# EAGLE board LEDpanel (EAGLE 6.6.0), part 1 of 2
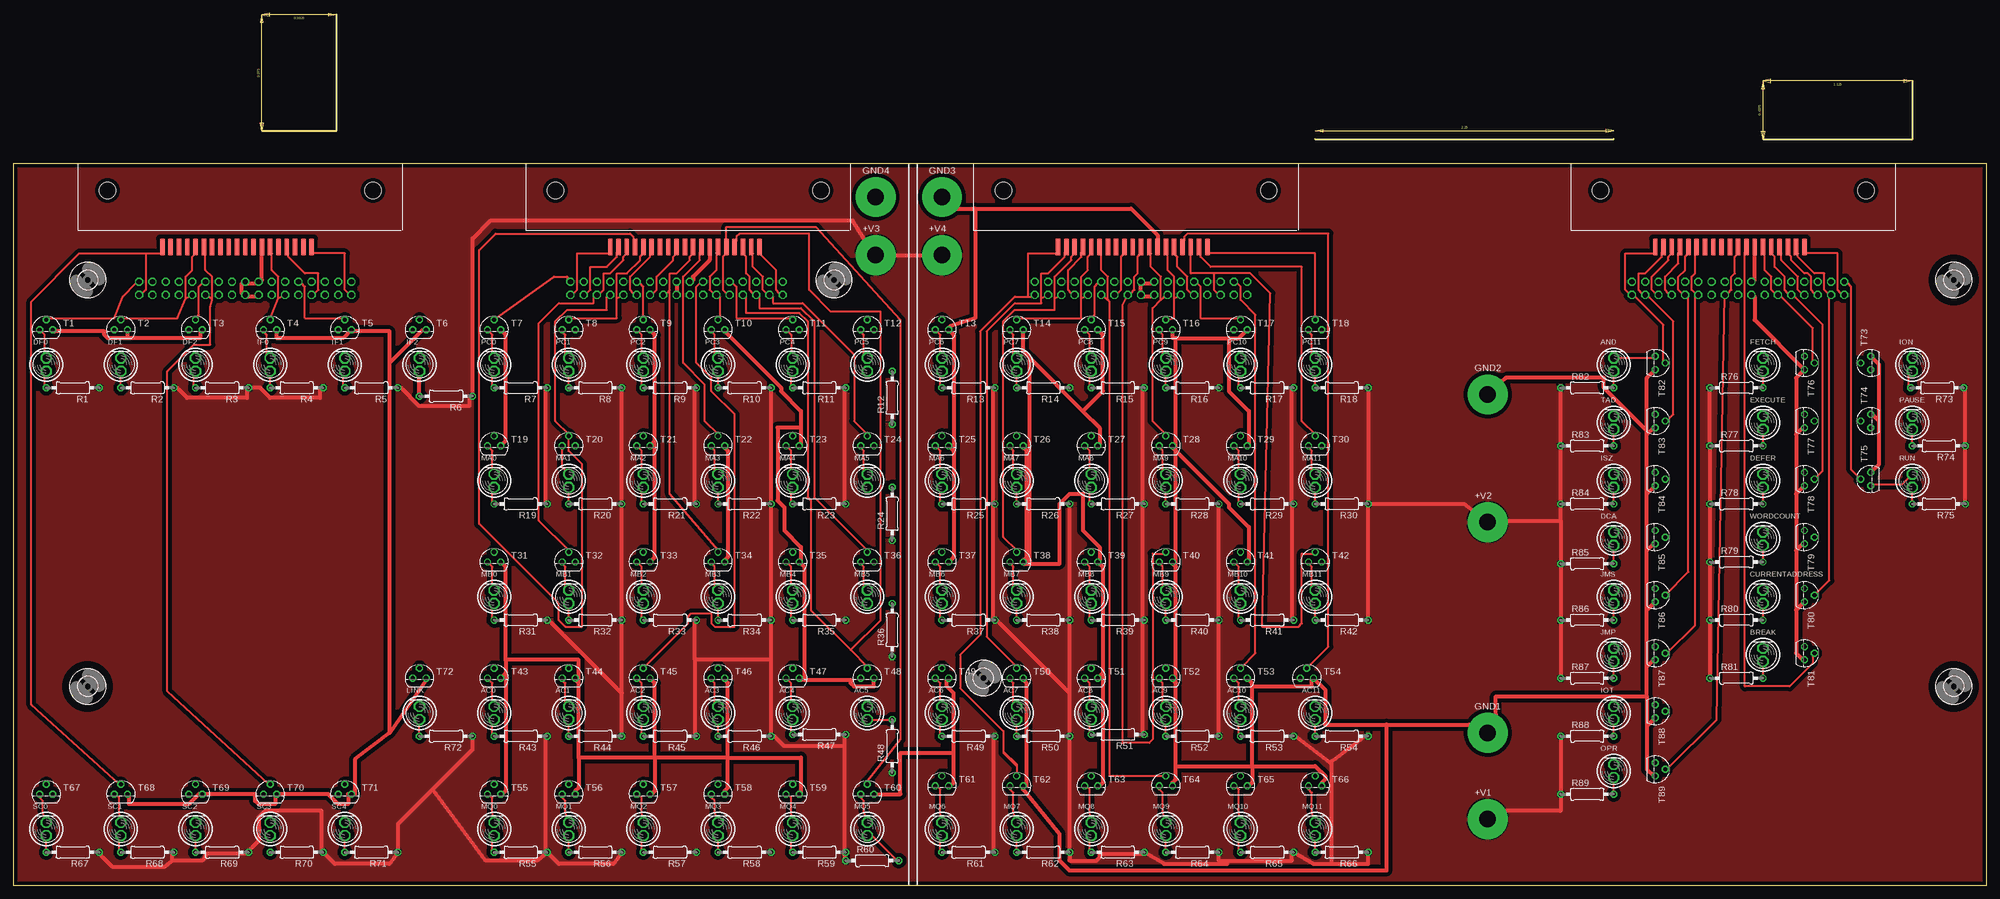
[diagram p2: board, top side]
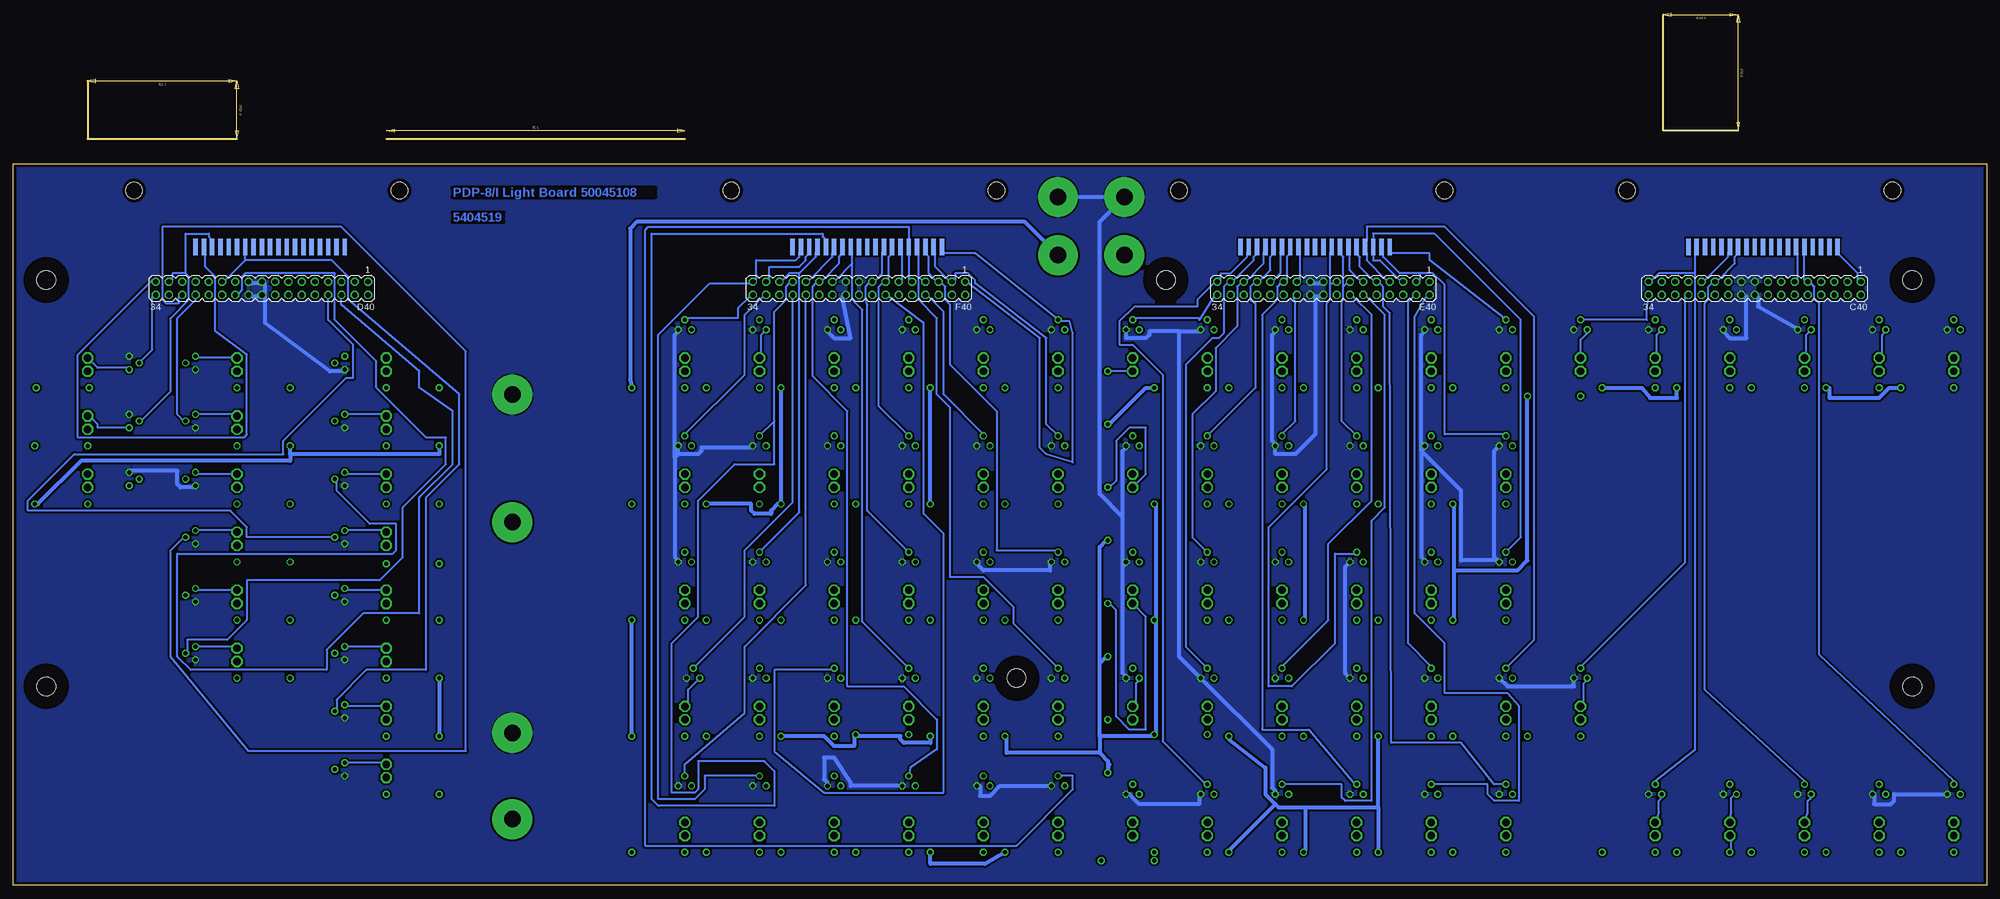
[diagram p3: board, bottom side, seen from below]

Size 377.82 x 166.69 mm. Coordinates in mm from the lower left corner, seen from the top.
Outline: 47.62,144.46 61.91,144.46 61.91,166.69
Outline: 334.96,142.88 363.54,142.88 363.54,153.99
Outline: 249.24,142.88 306.39,142.88
Outline: 377.82,0 377.82,138.11 0,138.11 0,0 377.82,0
Copper layers (1+16): Top 0.035mm / dielectric 1.5mm / Bottom 0.035mm
Design rules "15mils *": minimum track width 15mil, minimum drill 24mil, track to track 15mil, track to pad 10mil, pad to pad 10mil, via to via 10mil, smd to smd 10mil, copper to edge 25mil, drill to drill 10mil, minimum pad ring 10mil, minimum via ring 8mil, stop-mask expansion 0mil, vias tented up to drill 0mil, thermal gap 10mil
Net classes: 1 supply: width 0.762 mm

## Footprints (pad centres in the part's own frame; a part is rotated, then mirrored left to right if it is on the bottom)
SPADELUG = drill 3.175 pad 7.62: 1 0,0
BULB = drill 1.422 octagon: A 0,0; B 0,2.54
MA17-2 = drill 1.016 octagon: 1 -20.32,-1.27; 2 -20.32,1.27; 3 -17.78,-1.27; 4 -17.78,1.27; 5 -15.24,-1.27; 6 -15.24,1.27; 7 -12.7,-1.27; 8 -12.7,1.27; 9 -10.16,-1.27; 10 -10.16,1.27; 11 -7.62,-1.27; 12 -7.62,1.27; 13 -5.08,-1.27; 14 -5.08,1.27; 15 -2.54,-1.27; 16 -2.54,1.27; 17 0,-1.27; 18 0,1.27; 19 2.54,-1.27; 20 2.54,1.27; 21 5.08,-1.27; 22 5.08,1.27; 23 7.62,-1.27; 24 7.62,1.27; 25 10.16,-1.27; 26 10.16,1.27; 27 12.7,-1.27; 28 12.7,1.27; 29 15.24,-1.27; 30 15.24,1.27; 31 17.78,-1.27; 32 17.78,1.27; 33 20.32,-1.27; 34 20.32,1.27
FLEX19 = smd 3.175 x 0.838: 1 0,14.287; 2 0,12.7; 3 0,11.113; 4 0,9.525; 5 0,7.938; 6 0,6.35; 7 0,4.763; 8 0,3.175; 9 0,1.587; 10 0,0; 11 0,-1.587; 12 0,-3.175; 13 0,-4.763; 14 0,-6.35; 15 0,-7.938; 16 0,-9.525; 17 0,-11.113; 18 0,-12.7; 19 0,-14.287
0207/10 = drill 0.813 octagon: 1 -5.08,0; 2 5.08,0
TO92 = drill 0.813 octagon: 1 1.27,0; 2 0,1.905; 3 -1.27,0
STRAIN-RELIEF = hole 3.175: 7.62,56.515; 7.62,5.715
3,6 = hole 3.6: 0,0

## Placement (x,y rotation side)
+V1  LUG  [SPADELUG]  282.26,12.7 0 top
+V2  LUG  [SPADELUG]  282.26,69.53 0 top
+V3  LUG  [SPADELUG]  165.1,120.65 0 top
+V4  LUG  [SPADELUG]  177.8,120.65 0 top
AC0  [BULB]  92.08,31.75 0 top
AC1  [BULB]  106.36,31.75 0 top
AC2  [BULB]  120.65,31.75 0 top
AC3  [BULB]  134.94,31.75 0 top
AC4  [BULB]  149.22,31.75 0 top
AC5  [BULB]  163.51,31.75 0 top
AC6  [BULB]  177.8,31.75 0 top
AC7  [BULB]  192.09,31.75 0 top
AC8  [BULB]  206.38,31.75 0 top
AC9  [BULB]  220.66,31.75 0 top
AC10  [BULB]  234.95,31.75 0 top
AC11  [BULB]  249.24,31.75 0 top
AND  [BULB]  306.39,98.42 0 top
BREAK  [BULB]  334.96,42.86 0 top
C40  [MA17-2]  44.45,114.3 180 bottom
C40BOT  FLEX19  [FLEX19]  42.86,122.24 90 top
C40TOP  FLEX19  [FLEX19]  42.86,122.24 270 bottom
CURRENTADDRESS  [BULB]  334.96,53.98 0 top
D40  [MA17-2]  330.2,114.3 180 bottom
D40BOT  FLEX19  [FLEX19]  128.59,122.24 90 top
D40TOP  FLEX19  [FLEX19]  128.59,122.24 270 bottom
DCA  [BULB]  306.39,65.09 0 top
DEFER  [BULB]  334.96,76.2 0 top
DF0  [BULB]  6.35,98.42 0 top
DF1  [BULB]  20.64,98.42 0 top
DF2  [BULB]  34.92,98.42 0 top
E40  [MA17-2]  127,114.3 180 bottom
E40BOT  FLEX19  [FLEX19]  214.31,122.24 90 top
E40TOP  FLEX19  [FLEX19]  214.31,122.24 270 bottom
EXECUTE  [BULB]  334.96,87.31 0 top
F40  [MA17-2]  215.9,114.3 180 bottom
F40BOT  FLEX19  [FLEX19]  328.61,122.24 90 top
F40TOP  FLEX19  [FLEX19]  328.61,122.24 270 bottom
FETCH  [BULB]  334.96,98.42 0 top
GND1  LUG  [SPADELUG]  282.26,29.21 0 top
GND2  LUG  [SPADELUG]  282.26,93.98 0 top
GND3  LUG  [SPADELUG]  177.8,131.76 0 top
GND4  LUG  [SPADELUG]  165.1,131.76 0 top
IF0  [BULB]  49.21,98.42 0 top
IF1  [BULB]  63.5,98.42 0 top
IF2  [BULB]  77.79,98.42 0 top
ION  [BULB]  363.54,98.42 0 top
IOT  [BULB]  306.39,31.75 0 top
ISZ  [BULB]  306.39,76.2 0 top
JMP  [BULB]  306.39,42.86 0 top
JMS  [BULB]  306.39,53.98 0 top
LINK  [BULB]  77.79,31.75 0 top
MA0  [BULB]  92.08,76.2 0 top
MA1  [BULB]  106.36,76.2 0 top
MA2  [BULB]  120.65,76.2 0 top
MA3  [BULB]  134.94,76.2 0 top
MA4  [BULB]  149.22,76.2 0 top
MA5  [BULB]  163.51,76.2 0 top
MA6  [BULB]  177.8,76.2 0 top
MA7  [BULB]  192.09,76.2 0 top
MA8  [BULB]  206.38,76.2 0 top
MA9  [BULB]  220.66,76.2 0 top
MA10  [BULB]  234.95,76.2 0 top
MA11  [BULB]  249.24,76.2 0 top
MB0  [BULB]  92.08,53.98 0 top
MB1  [BULB]  106.36,53.98 0 top
MB2  [BULB]  120.65,53.98 0 top
MB3  [BULB]  134.94,53.98 0 top
MB4  [BULB]  149.22,53.98 0 top
MB5  [BULB]  163.51,53.98 0 top
MB6  [BULB]  177.8,53.98 0 top
MB7  [BULB]  192.09,53.98 0 top
MB8  [BULB]  206.38,53.98 0 top
MB9  [BULB]  220.66,53.98 0 top
MB10  [BULB]  234.95,53.98 0 top
MB11  [BULB]  249.24,53.98 0 top
MQ0  [BULB]  92.08,9.53 0 top
MQ1  [BULB]  106.36,9.53 0 top
MQ2  [BULB]  120.65,9.53 0 top
MQ3  [BULB]  134.94,9.53 0 top
MQ4  [BULB]  149.22,9.53 0 top
MQ5  [BULB]  163.51,9.53 0 top
MQ6  [BULB]  177.8,9.53 0 top
MQ7  [BULB]  192.09,9.53 0 top
MQ8  [BULB]  206.38,9.53 0 top
MQ9  [BULB]  220.66,9.53 0 top
MQ10  [BULB]  234.95,9.53 0 top
MQ11  [BULB]  249.24,9.53 0 top
OPR  [BULB]  306.39,20.64 0 top
PAUSE  [BULB]  363.54,87.31 0 top
PC0  [BULB]  92.08,98.42 0 top
PC1  [BULB]  106.36,98.42 0 top
PC2  [BULB]  120.65,98.42 0 top
PC3  [BULB]  134.94,98.42 0 top
PC4  [BULB]  149.22,98.42 0 top
PC5  [BULB]  163.51,98.42 0 top
PC6  [BULB]  177.8,98.42 0 top
PC7  [BULB]  192.09,98.42 0 top
PC8  [BULB]  206.38,98.42 0 top
PC9  [BULB]  220.66,98.42 0 top
PC10  [BULB]  234.95,98.42 0 top
PC11  [BULB]  249.24,98.42 0 top
R1  1.5K  [0207/10]  11.43,95.25 180 top
R2  1.5K  [0207/10]  25.72,95.25 180 top
R3  1.5K  [0207/10]  40.01,95.25 180 top
R4  1.5K  [0207/10]  54.29,95.25 180 top
R5  1.5K  [0207/10]  68.58,95.25 180 top
R6  1.5K  [0207/10]  82.87,93.66 180 top
R7  1.5K  [0207/10]  97.16,95.25 180 top
R8  1.5K  [0207/10]  111.44,95.25 180 top
R9  1.5K  [0207/10]  125.73,95.25 180 top
R10  1.5K  [0207/10]  140.02,95.25 180 top
R11  1.5K  [0207/10]  154.31,95.25 180 top
R12  1.5K  [0207/10]  168.28,93.34 90 top
R13  1.5K  [0207/10]  182.88,95.25 180 top
R14  1.5K  [0207/10]  197.17,95.25 180 top
R15  1.5K  [0207/10]  211.46,95.25 180 top
R16  1.5K  [0207/10]  225.74,95.25 180 top
R17  1.5K  [0207/10]  240.03,95.25 180 top
R18  1.5K  [0207/10]  254.32,95.25 180 top
R19  1.5K  [0207/10]  97.16,73.03 180 top
R20  1.5K  [0207/10]  111.44,73.03 180 top
R21  1.5K  [0207/10]  125.73,73.03 180 top
R22  1.5K  [0207/10]  140.02,73.03 180 top
R23  1.5K  [0207/10]  154.31,73.03 180 top
R24  1.5K  [0207/10]  168.28,71.12 90 top
R25  1.5K  [0207/10]  182.88,73.03 180 top
R26  1.5K  [0207/10]  197.17,73.03 180 top
R27  1.5K  [0207/10]  211.46,73.03 180 top
R28  1.5K  [0207/10]  225.74,73.03 180 top
R29  1.5K  [0207/10]  240.03,73.03 180 top
R30  1.5K  [0207/10]  254.32,73.03 180 top
R31  1.5K  [0207/10]  97.16,50.8 180 top
R32  1.5K  [0207/10]  111.44,50.8 180 top
R33  1.5K  [0207/10]  125.73,50.8 180 top
R34  1.5K  [0207/10]  140.02,50.8 180 top
R35  1.5K  [0207/10]  154.31,50.8 180 top
R36  1.5K  [0207/10]  168.28,48.9 90 top
R37  1.5K  [0207/10]  182.88,50.8 180 top
R38  1.5K  [0207/10]  197.17,50.8 180 top
R39  1.5K  [0207/10]  211.46,50.8 180 top
R40  1.5K  [0207/10]  225.74,50.8 180 top
R41  1.5K  [0207/10]  240.03,50.8 180 top
R42  1.5K  [0207/10]  254.32,50.8 180 top
R43  1.5K  [0207/10]  97.16,28.57 180 top
R44  1.5K  [0207/10]  111.44,28.57 180 top
R45  1.5K  [0207/10]  125.73,28.57 180 top
R46  1.5K  [0207/10]  140.02,28.57 180 top
R47  1.5K  [0207/10]  154.31,28.89 180 top
R48  1.5K  [0207/10]  168.28,26.67 90 top
R49  1.5K  [0207/10]  182.88,28.57 180 top
R50  1.5K  [0207/10]  197.17,28.57 180 top
R51  1.5K  [0207/10]  211.46,28.89 180 top
R52  1.5K  [0207/10]  225.74,28.57 180 top
R53  1.5K  [0207/10]  240.03,28.57 180 top
R54  1.5K  [0207/10]  254.32,28.57 180 top
R55  1.5K  [0207/10]  97.16,6.35 180 top
R56  1.5K  [0207/10]  111.44,6.35 180 top
R57  1.5K  [0207/10]  125.73,6.35 180 top
R58  1.5K  [0207/10]  140.02,6.35 180 top
R59  1.5K  [0207/10]  154.31,6.35 180 top
R60  1.5K  [0207/10]  164.47,4.76 0 top
R61  1.5K  [0207/10]  182.88,6.35 180 top
R62  1.5K  [0207/10]  197.17,6.35 180 top
R63  1.5K  [0207/10]  211.46,6.35 180 top
R64  1.5K  [0207/10]  225.74,6.35 180 top
R65  1.5K  [0207/10]  240.03,6.35 180 top
R66  1.5K  [0207/10]  254.32,6.35 180 top
R67  1.5K  [0207/10]  11.43,6.35 180 top
R68  1.5K  [0207/10]  25.72,6.35 180 top
R69  1.5K  [0207/10]  40.01,6.35 180 top
R70  1.5K  [0207/10]  54.29,6.35 180 top
R71  1.5K  [0207/10]  68.58,6.35 180 top
R72  1.5K  [0207/10]  82.87,28.57 180 top
R73  1.5K  [0207/10]  368.3,95.25 180 top
R74  1.5K  [0207/10]  368.62,84.14 180 top
R75  1.5K  [0207/10]  368.62,73.03 180 top
R76  1.5K  [0207/10]  329.88,95.25 0 top
R77  1.5K  [0207/10]  329.88,84.14 0 top
R78  1.5K  [0207/10]  329.88,73.03 0 top
R79  1.5K  [0207/10]  329.88,61.91 0 top
R80  1.5K  [0207/10]  329.88,50.8 0 top
R81  1.5K  [0207/10]  329.88,39.69 0 top
R82  1.5K  [0207/10]  301.31,95.25 0 top
R83  1.5K  [0207/10]  301.31,84.14 0 top
R84  1.5K  [0207/10]  301.31,73.03 0 top
R85  1.5K  [0207/10]  301.31,61.59 0 top
R86  1.5K  [0207/10]  301.31,50.8 0 top
R87  1.5K  [0207/10]  301.31,39.69 0 top
R88  1.5K  [0207/10]  301.31,28.57 0 top
R89  1.5K  [0207/10]  301.31,17.46 0 top
RUN  [BULB]  363.54,76.2 0 top
SC0  [BULB]  6.35,9.53 0 top
SC1  [BULB]  20.64,9.53 0 top
SC2  [BULB]  34.92,9.53 0 top
SC3  [BULB]  49.21,9.53 0 top
SC4  [BULB]  63.5,9.53 0 top
T1  2N2222  [TO92]  6.35,106.36 0 top
T2  2N2222  [TO92]  20.64,106.36 0 top
T3  2N2222  [TO92]  34.92,106.36 0 top
T4  2N2222  [TO92]  49.21,106.36 0 top
T5  2N2222  [TO92]  63.5,106.36 0 top
T6  2N2222  [TO92]  77.79,106.36 0 top
T7  2N2222  [TO92]  92.08,106.36 0 top
T8  2N2222  [TO92]  106.36,106.36 0 top
T9  2N2222  [TO92]  120.65,106.36 0 top
T10  2N2222  [TO92]  134.94,106.36 0 top
T11  2N2222  [TO92]  149.22,106.36 0 top
T12  2N2222  [TO92]  163.51,106.36 0 top
T13  2N2222  [TO92]  177.8,106.36 0 top
T14  2N2222  [TO92]  192.09,106.36 0 top
T15  2N2222  [TO92]  206.38,106.36 0 top
T16  2N2222  [TO92]  220.66,106.36 0 top
T17  2N2222  [TO92]  234.95,106.36 0 top
T18  2N2222  [TO92]  249.24,106.36 0 top
T19  2N2222  [TO92]  92.08,84.14 0 top
T20  2N2222  [TO92]  106.36,84.14 0 top
T21  2N2222  [TO92]  120.65,84.14 0 top
T22  2N2222  [TO92]  134.94,84.14 0 top
T23  2N2222  [TO92]  149.22,84.14 0 top
T24  2N2222  [TO92]  163.51,84.14 0 top
T25  2N2222  [TO92]  177.8,84.14 0 top
T26  2N2222  [TO92]  192.09,84.14 0 top
T27  2N2222  [TO92]  206.38,84.14 0 top
T28  2N2222  [TO92]  220.66,84.14 0 top
T29  2N2222  [TO92]  234.95,84.14 0 top
T30  2N2222  [TO92]  249.24,84.14 0 top
T31  2N2222  [TO92]  92.08,61.91 0 top
T32  2N2222  [TO92]  106.36,61.91 0 top
T33  2N2222  [TO92]  120.65,61.91 0 top
T34  2N2222  [TO92]  134.94,61.91 0 top
T35  2N2222  [TO92]  149.22,61.91 0 top
T36  2N2222  [TO92]  163.51,61.91 0 top
T37  2N2222  [TO92]  177.8,61.91 0 top
T38  2N2222  [TO92]  192.09,61.91 0 top
T39  2N2222  [TO92]  206.38,61.91 0 top
T40  2N2222  [TO92]  220.66,61.91 0 top
T41  2N2222  [TO92]  234.95,61.91 0 top
T42  2N2222  [TO92]  249.24,61.91 0 top
T43  2N2222  [TO92]  92.08,39.69 0 top
T44  2N2222  [TO92]  106.36,39.69 0 top
T45  2N2222  [TO92]  120.65,39.69 0 top
T46  2N2222  [TO92]  134.94,39.69 0 top
T47  2N2222  [TO92]  149.22,39.69 0 top
T48  2N2222  [TO92]  163.51,39.69 0 top
T49  2N2222  [TO92]  177.8,39.69 0 top
T50  2N2222  [TO92]  192.09,39.69 0 top
T51  2N2222  [TO92]  206.38,39.69 0 top
T52  2N2222  [TO92]  220.66,39.69 0 top
T53  2N2222  [TO92]  234.95,39.69 0 top
T54  2N2222  [TO92]  247.65,39.69 0 top
T55  2N2222  [TO92]  92.08,17.46 0 top
T56  2N2222  [TO92]  106.36,17.46 0 top
T57  2N2222  [TO92]  120.65,17.46 0 top
T58  2N2222  [TO92]  134.94,17.46 0 top
T59  2N2222  [TO92]  149.22,17.46 0 top
T60  2N2222  [TO92]  163.51,17.46 0 top
T61  2N2222  [TO92]  177.8,19.05 0 top
T62  2N2222  [TO92]  192.09,19.05 0 top
T63  2N2222  [TO92]  206.38,19.05 0 top
T64  2N2222  [TO92]  220.66,19.05 0 top
T65  2N2222  [TO92]  234.95,19.05 0 top
T66  2N2222  [TO92]  249.24,19.05 0 top
T67  2N2222  [TO92]  6.35,17.46 0 top
T68  2N2222  [TO92]  20.64,17.46 0 top
T69  2N2222  [TO92]  34.92,17.46 0 top
T70  2N2222  [TO92]  49.21,17.46 0 top
T71  2N2222  [TO92]  63.5,17.46 0 top
T72  2N2222  [TO92]  77.79,39.69 0 top
T73  2N2222  [TO92]  355.6,100.01 90 top
T74  2N2222  [TO92]  355.6,88.9 90 top
T75  2N2222  [TO92]  355.6,77.79 90 top
T76  2N2222  [TO92]  342.9,100.01 270 top
T77  2N2222  [TO92]  342.9,88.9 270 top
T78  2N2222  [TO92]  342.9,77.79 270 top
T79  2N2222  [TO92]  342.9,66.67 270 top
T80  2N2222  [TO92]  342.9,55.56 270 top
T81  2N2222  [TO92]  342.9,44.45 270 top
T82  2N2222  [TO92]  314.32,100.01 270 top
T83  2N2222  [TO92]  314.32,88.9 270 top
T84  2N2222  [TO92]  314.32,77.79 270 top
T85  2N2222  [TO92]  314.32,66.67 270 top
T86  2N2222  [TO92]  314.32,55.56 270 top
T87  2N2222  [TO92]  314.32,44.45 270 top
T88  2N2222  [TO92]  314.32,33.34 270 top
T89  2N2222  [TO92]  314.32,22.23 270 top
TAD  [BULB]  306.39,87.31 0 top
U$1  [STRAIN-RELIEF]  74.61,125.41 90 top
U$2  [STRAIN-RELIEF]  160.34,125.41 90 top
U$3  [STRAIN-RELIEF]  246.06,125.41 90 top
U$4  [STRAIN-RELIEF]  360.36,125.41 90 top
U$5  [3,6]  371.48,115.89 0 top
U$6  [3,6]  371.48,38.1 0 top
U$7  [3,6]  185.74,39.69 0 top
U$8  [3,6]  14.29,38.1 0 top
U$9  [3,6]  14.29,115.89 0 top
U$11  [3,6]  157.16,115.89 0 top
WORDCOUNT  [BULB]  334.96,65.09 0 top